# Altium schematic sheet USB_Host_Mouse_And_Keyboard.SchDoc
size A; DocumentNumber: 1; SheetNumber: 1; SheetTotal: 1
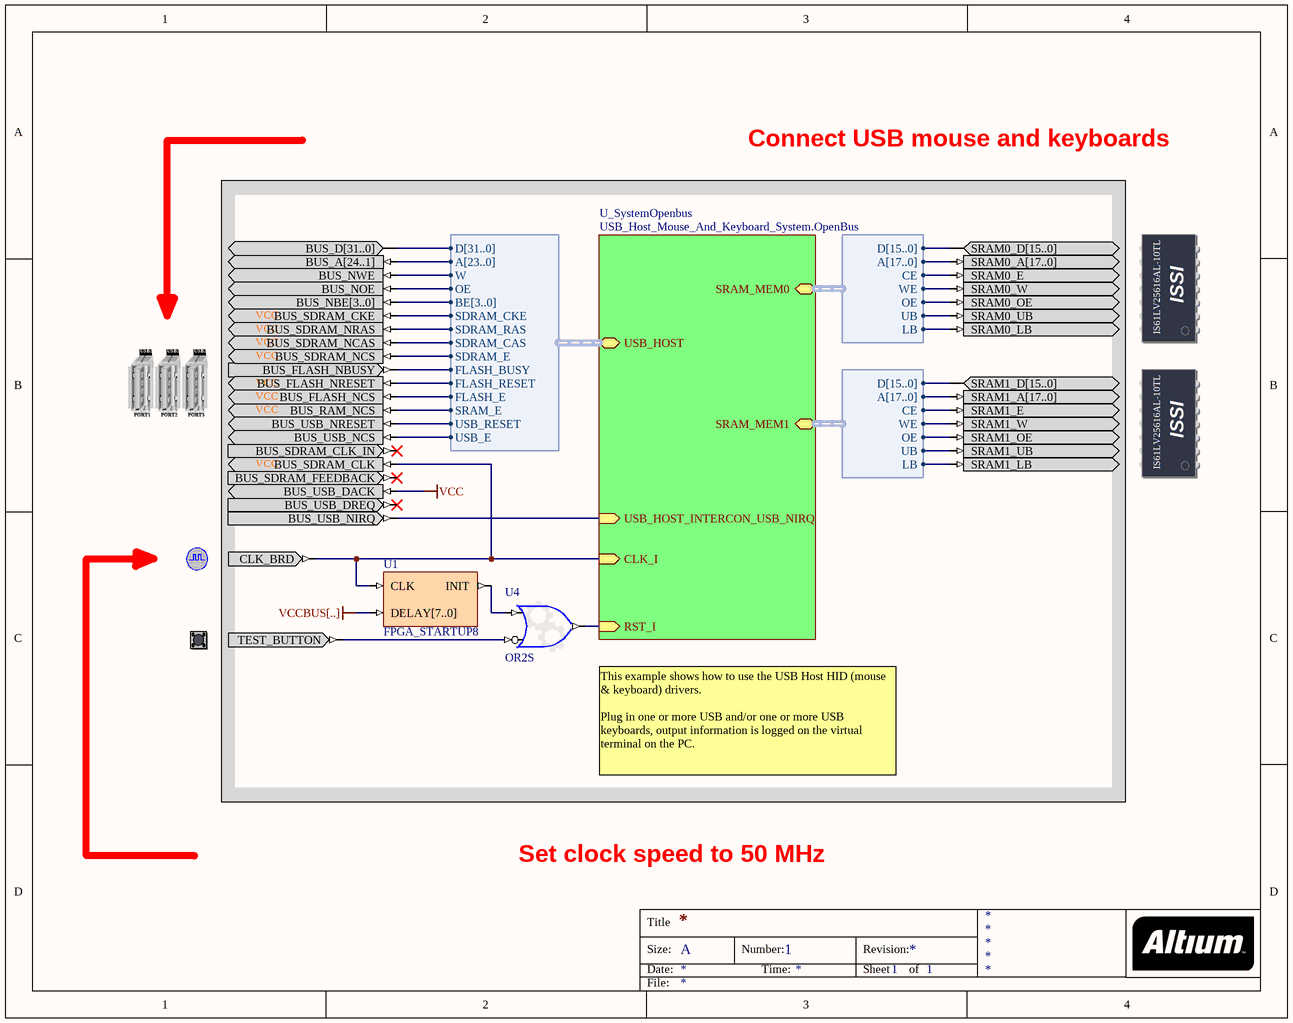
[diagram p0: USB_Host_Mouse_And_Keyboard.SchDoc]

## Parts
(Parts that share a designator on the sheet are numbered #1, #2 ... from top to bottom, then left to right.)
?#1  SHARED_USB  (value not drawn)
?#2  SRAM0  (value not drawn)
?#3  SRAM1  (value not drawn)
?#4  CLOCK_BOARD  (value not drawn)
?#5  TEST_BUTTON  (value not drawn)
U1  FPGA_STARTUP8
U4  OR2S

## Sub-sheets
U_SystemOpenbus = USB_Host_Mouse_And_Keyboard_System.OpenBus: RST_I (in), CLK_I (in), SRAM_MEM0 (harness WB_MEM_CTRL_SRAM16_A18), SRAM_MEM1 (harness WB_MEM_CTRL_SRAM16_A18), USB_HOST (harness WB_SHARED_MEM_CTRL), USB_HOST_INTERCON_USB_NIRQ (in)

## Harnesses
WB_MEM_CTRL_SRAM16_A18: D[15..0], A[17..0], CE, WE, OE, UB, LB
WB_SHARED_MEM_CTRL: D[31..0], A[23..0], W, OE, BE[3..0], SDRAM_CKE, SDRAM_RAS, SDRAM_CAS, SDRAM_E, FLASH_BUSY, FLASH_RESET, FLASH_E, SRAM_E, USB_RESET, USB_E

## Nets
VCC: ?#1.BUS_USB_DACK
VCCBUS[..]: U1.DELAY[7..0]
Net?#1_BUS_A[24..1]: ?#1.BUS_A[24..1] ; sheet U_SystemOpenbus/USB_HOST.A[23..0]
Net?#1_BUS_D[31..0]: ?#1.BUS_D[31..0] ; sheet U_SystemOpenbus/USB_HOST.D[31..0]
Net?#1_BUS_FLASH_NBUSY: ?#1.BUS_FLASH_NBUSY ; sheet U_SystemOpenbus/USB_HOST.FLASH_BUSY
Net?#1_BUS_FLASH_NCS: ?#1.BUS_FLASH_NCS ; sheet U_SystemOpenbus/USB_HOST.FLASH_E
Net?#1_BUS_FLASH_NRESET: ?#1.BUS_FLASH_NRESET ; sheet U_SystemOpenbus/USB_HOST.FLASH_RESET
Net?#1_BUS_NBE[3..0]: ?#1.BUS_NBE[3..0] ; sheet U_SystemOpenbus/USB_HOST.BE[3..0]
Net?#1_BUS_NOE: ?#1.BUS_NOE ; sheet U_SystemOpenbus/USB_HOST.OE
Net?#1_BUS_NWE: ?#1.BUS_NWE ; sheet U_SystemOpenbus/USB_HOST.W
Net?#1_BUS_RAM_NCS: ?#1.BUS_RAM_NCS ; sheet U_SystemOpenbus/USB_HOST.SRAM_E
Net?#1_BUS_SDRAM_CKE: ?#1.BUS_SDRAM_CKE ; sheet U_SystemOpenbus/USB_HOST.SDRAM_CKE
Net?#1_BUS_SDRAM_CLK: ?#1.BUS_SDRAM_CLK ?#4.CLK_BRD U1.CLK ; sheet U_SystemOpenbus/CLK_I
Net?#1_BUS_SDRAM_NCAS: ?#1.BUS_SDRAM_NCAS ; sheet U_SystemOpenbus/USB_HOST.SDRAM_CAS
Net?#1_BUS_SDRAM_NCS: ?#1.BUS_SDRAM_NCS ; sheet U_SystemOpenbus/USB_HOST.SDRAM_E
Net?#1_BUS_SDRAM_NRAS: ?#1.BUS_SDRAM_NRAS ; sheet U_SystemOpenbus/USB_HOST.SDRAM_RAS
Net?#1_BUS_USB_NCS: ?#1.BUS_USB_NCS ; sheet U_SystemOpenbus/USB_HOST.USB_E
Net?#1_BUS_USB_NIRQ: ?#1.BUS_USB_NIRQ ; sheet U_SystemOpenbus/USB_HOST_INTERCON_USB_NIRQ
Net?#1_BUS_USB_NRESET: ?#1.BUS_USB_NRESET ; sheet U_SystemOpenbus/USB_HOST.USB_RESET
Net?#2_SRAM0_A[17..0]: ?#2.SRAM0_A[17..0] ; sheet U_SystemOpenbus/SRAM_MEM0.A[17..0]
Net?#2_SRAM0_D[15..0]: ?#2.SRAM0_D[15..0] ; sheet U_SystemOpenbus/SRAM_MEM0.D[15..0]
Net?#2_SRAM0_E: ?#2.SRAM0_E ; sheet U_SystemOpenbus/SRAM_MEM0.CE
Net?#2_SRAM0_LB: ?#2.SRAM0_LB ; sheet U_SystemOpenbus/SRAM_MEM0.LB
Net?#2_SRAM0_OE: ?#2.SRAM0_OE ; sheet U_SystemOpenbus/SRAM_MEM0.OE
Net?#2_SRAM0_UB: ?#2.SRAM0_UB ; sheet U_SystemOpenbus/SRAM_MEM0.UB
Net?#2_SRAM0_W: ?#2.SRAM0_W ; sheet U_SystemOpenbus/SRAM_MEM0.WE
Net?#3_SRAM1_A[17..0]: ?#3.SRAM1_A[17..0] ; sheet U_SystemOpenbus/SRAM_MEM1.A[17..0]
Net?#3_SRAM1_D[15..0]: ?#3.SRAM1_D[15..0] ; sheet U_SystemOpenbus/SRAM_MEM1.D[15..0]
Net?#3_SRAM1_E: ?#3.SRAM1_E ; sheet U_SystemOpenbus/SRAM_MEM1.CE
Net?#3_SRAM1_LB: ?#3.SRAM1_LB ; sheet U_SystemOpenbus/SRAM_MEM1.LB
Net?#3_SRAM1_OE: ?#3.SRAM1_OE ; sheet U_SystemOpenbus/SRAM_MEM1.OE
Net?#3_SRAM1_UB: ?#3.SRAM1_UB ; sheet U_SystemOpenbus/SRAM_MEM1.UB
Net?#3_SRAM1_W: ?#3.SRAM1_W ; sheet U_SystemOpenbus/SRAM_MEM1.WE
Net?#5_TEST_BUTTON: ?#5.TEST_BUTTON U4.I1
NetU1_INIT: U1.INIT U4.I0
NetU4_O: U4.O ; sheet U_SystemOpenbus/RST_I

Not connected (* = marked no-connect by the designer): ?#1 BUS_SDRAM_CLK_IN* BUS_SDRAM_FEEDBACK* BUS_USB_DREQ*

## Notes on the sheet
- Connect USB mouse and keyboards
- (near U4) This example shows how to use the USB Host HID (mouse & keyboard) drivers.
  Plug in one or more USB and/or one or more USB keyboards, output information is logged on the virtual terminal on the PC.
- Set clock speed to 50 MHz
- Title
- Size:
- Date:
- A
- Number:
- Time:
- Revision:
- Sheet
- of
- File:
- (in symbol SHARED_USB) VCC; USB2; PORT1; PORT2; PORT3
- (in symbol SRAM0) ISSI; IS61LV25616AL-10TL
- (in symbol SRAM1) ISSI; IS61LV25616AL-10TL

## Library data of the parts
?#1 = SHARED_USB: Common-Bus USB; PortComponent: True; Published: 14-May-2007; Publisher: Altium Limited; HelpURL: TR0149 Technical Reference for Altium's Xilinx Spartan-3 Daughter Board DB30.pdf#page=15
?#2 = SRAM0: Free Static RAM - Daughterboard; PortComponent: True; Published: 14-May-2007; Publisher: Altium Limited; HelpURL: https://wiki.altium.com/display/ADOH/NanoBoard+3000+-+Independent+SRAM
?#3 = SRAM1: Free Static RAM - Daughterboard; PortComponent: True; Published: 14-May-2007; Publisher: Altium Limited; HelpURL: https://wiki.altium.com/display/ADOH/NanoBoard+3000+-+Independent+SRAM
?#4 = CLOCK_BOARD: Global System Clock Supply; PortComponent: True; Published: 19-Nov-2003; Publisher: Altium Limited; HelpURL: TR0143 Technical Reference Manual for Altium's Desktop NanoBoard NB2DSK01.pdf#page=41; UseInDSF: True
?#5 = TEST_BUTTON: Test / Reset Button; PortComponent: True; Published: 19-Nov-2003; Publisher: Altium Limited; HelpURL: TR0143 Technical Reference Manual for Altium's Desktop NanoBoard NB2DSK01.pdf#page=53
U1 = FPGA_STARTUP8: FPGA Startup With 8 Bit Delay; Published: 9-Dec-2004; Publisher: Altium Limited; ComponentLink1Description: Core &Resource Usage; ComponentLink1URL: CR0139 FPGA Peripheral Resource Usage.pdf#page=11; HelpURL: CR0119 FPGA_STARTUPx Powerup Delay Unit.pdf; LastRevisionNo: 1.00.00
U4 = GATE: Configurable Generic Gate; ConfiguratorName: GENERIC_GATE; ConfigurationParameters: {}Version[1.0]{}GateKind[OR]{}BusInput[False]{}GateInputType[Bit]{}GateOutputOption[Normal]{}BusWidth[8]{}RegisterOutputs[False]{}NegativeClockEdge[False]{}InputCount[2]{}InputInvert0[False]{}InputInvert1[True]{}; LastRevisionNo: 1.00.00; Published: 3-Sep-2008; Publisher: Altium Limited